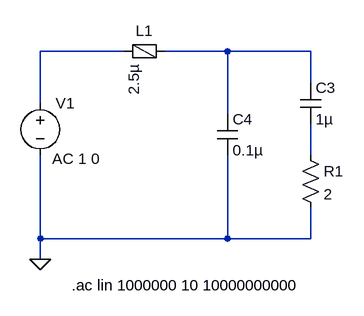
[diagram p0: schematic Ferrite_sim.asc]
Ferrite_sim.asc, the LTspice schematic file:
Version 4.1
SHEET 1 1100 680
WIRE 160 0 32 0
WIRE 320 0 224 0
WIRE 448 0 320 0
WIRE 448 48 448 0
WIRE 32 80 32 0
WIRE 320 96 320 0
WIRE 448 160 448 112
WIRE 32 288 32 160
WIRE 320 288 320 160
WIRE 320 288 32 288
WIRE 448 288 448 240
WIRE 448 288 320 288
WIRE 32 320 32 288
FLAG 32 320 0
SYMBOL FerriteBead 192 0 R90
WINDOW 0 -16 0 VBottom 2
SYMATTR InstName L1
SYMATTR Value 2.5µ
SYMATTR SpiceLine Ipk=1 Rser=0.157 Rpar=605 Cpar=1.1p
SYMBOL voltage 32 64 R0
WINDOW 123 18 101 Left 2
WINDOW 39 0 0 Left 0
SYMATTR Value2 AC 1 0
SYMATTR InstName V1
SYMATTR Value ""
SYMBOL cap 432 48 R0
SYMATTR InstName C3
SYMATTR Value 1µ
SYMATTR SpiceLine V=6.3 Irms=0 Rser=0.0109 Lser=230p mfg="Würth Elektronik" pn="885012104011 WCAP-CSGP 0201" type="X5R"
SYMBOL cap 304 96 R0
SYMATTR InstName C4
SYMATTR Value 0.1µ
SYMATTR SpiceLine V=6.3 Irms=0 Rser=0.0337 Lser=180p mfg="Würth Elektronik" pn="885012104009 WCAP-CSGP 0201" type="X5R"
SYMBOL res 432 144 R0
SYMATTR InstName R1
SYMATTR Value 2
SYMATTR SpiceLine tol=1 pwr=0.1
TEXT 80 360 Left 2 !.ac lin 1000000 10 10000000000

The netlist it stands for:
* Ferrite_sim.asc
L1 N002 N001 2.5µ Ipk=1 Rser=0.157 Rpar=605 Cpar=1.1p
V1 N001 0 AC 1 0
C3 N002 N003 1µ V=6.3 Irms=0 Rser=0.0109 Lser=230p mfg="Würth Elektronik" pn="885012104011 WCAP-CSGP 0201" type="X5R"
C4 N002 0 0.1µ V=6.3 Irms=0 Rser=0.0337 Lser=180p mfg="Würth Elektronik" pn="885012104009 WCAP-CSGP 0201" type="X5R"
R1 N003 0 2 tol=1 pwr=0.1
.ac lin 1000000 10 10000000000
.backanno
.end